# Altium schematic sheet CAN transciver.SchDoc: CAN transciever
size A; DrawnBy: Nilesh Amarathunge; Revision: V1.0; SheetNumber: 4; SheetTotal: 4
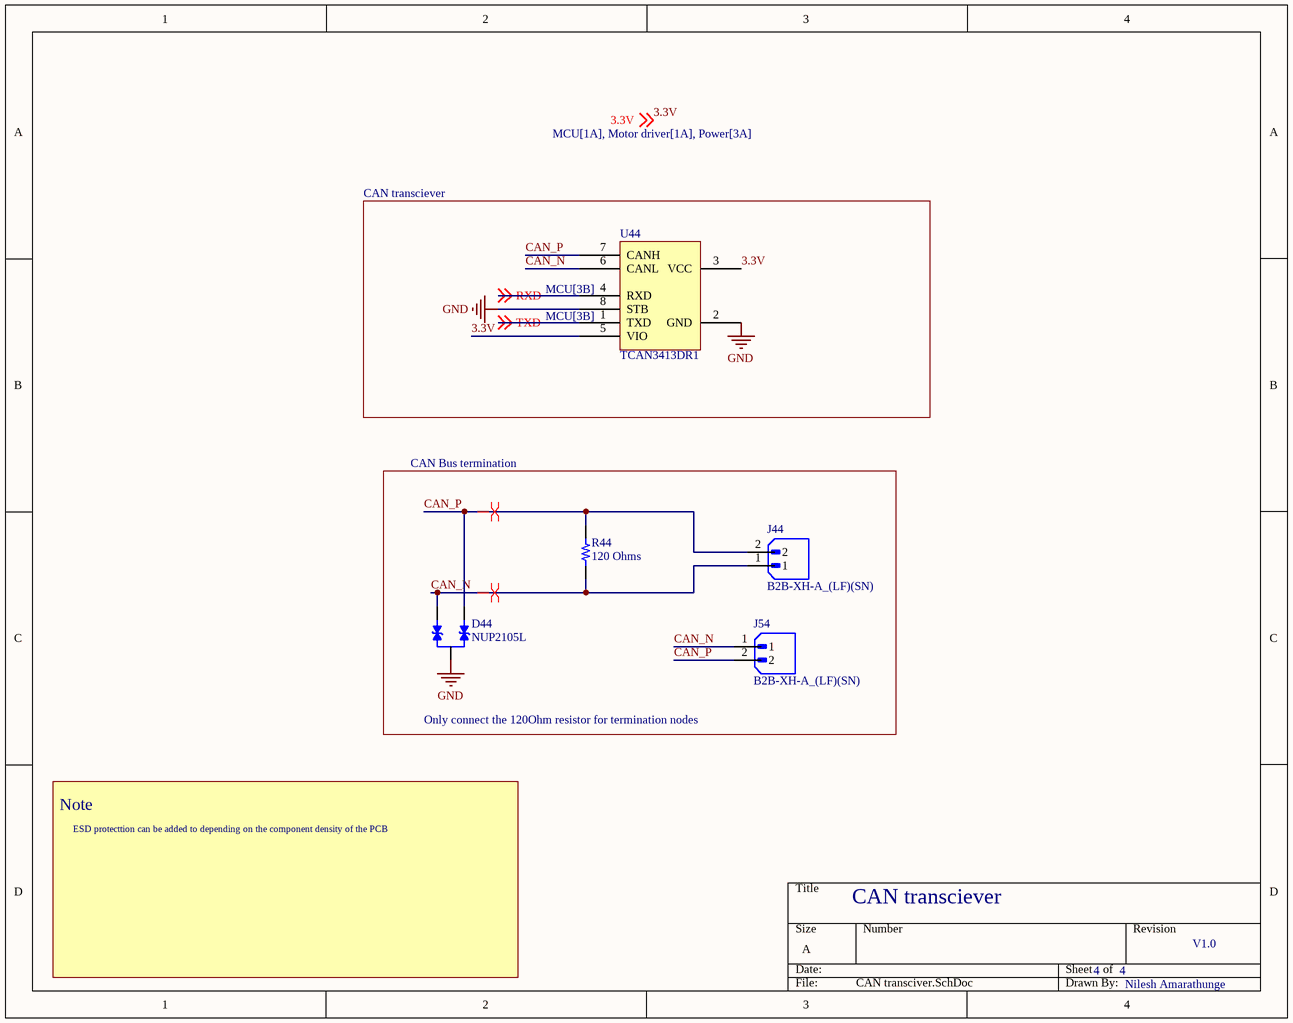
[diagram p0: CAN transciver.SchDoc]

## Parts
D44  NUP2105L  [SOT95P240X120-3N]
J44  B2B-XH-A_(LF)(SN)  [JST_B2B-XH-A_(LF)(SN)]
J54  B2B-XH-A_(LF)(SN)  [JST_B2B-XH-A_(LF)(SN)]
R44  120 Ohms  [RES 0805_2012]
U44  TCAN3413DR1  [TCAN3413DR1]

## Blocks framed on the sheet
CAN transciever: U44

## Nets
GND: D44.3 U44.2(GND) U44.8(STB)
3.3V: U44.3(VCC) U44.5(VIO) ; off-sheet 3.3V
CAN_N: D44.2 J44.1 J54.1 R44.1 U44.6(CANL)
CAN_P: D44.1 J44.2 J54.2 R44.2 U44.7(CANH)
RXD: U44.4(RXD) ; off-sheet RXD
TXD: U44.1(TXD) ; off-sheet TXD

## Layout directives
differential pair: CAN_N, CAN_P

## Notes on the sheet
- CAN Bus termination
- Only connect the 120Ohm resistor for termination nodes
- Note
- ESD protecttion can be added to depending on the component density of the PCB

## Library data of the parts
D44 = NUP2105L: ESD, SOT-23, 0.1ÂµA, 24V, Unidir; MF: Diotec Semiconductor; SnapEDA_Link: https://www.snapeda.com/parts/NUP2105L/Diotec/view-part/?ref=snap; Package: SOT-23 Diotec; Value: *; MP: NUP2105L; Check_prices: https://www.snapeda.com/parts/NUP2105L/Diotec/view-part/?ref=eda; LCSC part #: C14486
J44 J54 = B2B-XH-A_(LF)(SN): Connector Header Through Hole 2 position 0.098 (2.50mm); MF: JST Sales; MP: B2B-XH-A (LF)(SN); SnapEDA_Link: https://www.snapeda.com/parts/B2B-XH-A%20(LF)(SN)/JST+Sales+America+Inc./view-part/?ref=snap; Package: None; Value: *; Check_prices: https://www.snapeda.com/parts/B2B-XH-A%20(LF)(SN)/JST+Sales+America+Inc./view-part/?ref=eda; LCSC part #: C19271386
R44 = ERJ-6GEYJ121V: RES SMD 120 OHM 5% 1/8W 0805; Manufacturer: Panasonic Electronic Components; Power (Watts): 0.125W, 1/8W; Temperature Coefficient: ±200ppm/°C; Part Number: ERJ-6GEYJ121V; Value: 120 Ohms; ComponentLink1Description: Datasheet; ComponentLink1URL: http://industrial.panasonic.com/www-cgi/jvcr13pz.cgi?E+PZ+3+AOA0001+ERJ6GEYJ121V+7+WW; ComponentLink2Description: DigiKey Link; ComponentLink2URL: https://www.digikey.com/en/products/detail/panasonic-electronic-components/ERJ-6GEYJ121V/89685; Composition: Thick Film; Device Package: 0805 (2012 Metric); Features: Automotive AEC-Q200; Height - Seated (Max): 0.028" (0.70mm); LastUpdated: 2024-02-08 9:02:29 PM; Lifecycle Status: Active; Minimum Order: 1; Number of Terminations: 2; Operating Temperature: -55°C ~ 155°C; Package / Case: 0805 (2012 Metric); Packaging: TapeAndReel; PartId: 30081; Part Status: Active; Price: 0.01; Ratings: AEC-Q200; Resistance: 120 Ohms; Series: ERJ-6G; Size / Dimension: 0.079" L x 0.049" W (2.00mm x 1.25mm); Supplier 1: DigiKey; Supplier Part Number 1: P120ACT-ND; Supplier Device Package: 0805; Tolerance: ±5%; LCSC part #: C410053
U44 = TCAN3413DR1: LCSC part #: C22396693